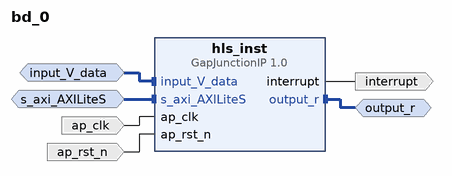
[diagram p0: block diagram of the top level]
# Vivado block design bd_0, xc7z020clg484-1, Vivado 2018.3
create_bd_design bd_0

create_bd_intf_port -mode Slave -vlnv xilinx.com:interface:axis_rtl:1.0 input_V_data
set_property -dict [list \
  CONFIG.FREQ_HZ 100000000.0 \
  CONFIG.HAS_TKEEP 0 \
  CONFIG.HAS_TLAST 0 \
  CONFIG.HAS_TREADY 1 \
  CONFIG.HAS_TSTRB 0 \
  CONFIG.LAYERED_METADATA {xilinx.com:interface:datatypes:1.0 {TDATA {datatype {name {attribs {resolve_type immediate dependency {} format string minimum {} maximum {}} value {}} bitwidth {attribs {resolve_type automatic dependency {} format long minimum {} maximum {}} value 0} bitoffset {attribs {resolve_type immediate dependency {} format long minimum {} maximum {}} value 0} array_type {name {attribs {resolve_type immediate dependency {} format string minimum {} maximum {}} value {}} size {attribs {resolve_type immediate dependency {} format long minimum {} maximum {}} value 2} stride {attribs {resolve_type immediate dependency {} format long minimum {} maximum {}} value 32} datatype {name {attribs {resolve_type immediate dependency {} format string minimum {} maximum {}} value {}} bitwidth {attribs {resolve_type immediate dependency {} format long minimum {} maximum {}} value 32} bitoffset {attribs {resolve_type immediate dependency {} format long minimum {} maximum {}} value 0} real {float {sigwidth {attribs {resolve_type immediate dependency {} format long minimum {} maximum {}} value 24}}}}}}}}} \
  CONFIG.TDATA_NUM_BYTES 8 \
  CONFIG.TDEST_WIDTH 0 \
  CONFIG.TID_WIDTH 0 \
  CONFIG.TUSER_WIDTH 0 \
] [get_bd_intf_ports input_V_data]
create_bd_intf_port -mode Master -vlnv xilinx.com:interface:axis_rtl:1.0 output_r
set_property -dict {CONFIG.FREQ_HZ 100000000.0} [get_bd_intf_ports output_r]
create_bd_intf_port -mode Slave -vlnv xilinx.com:interface:aximm_rtl:1.0 s_axi_AXILiteS
set_property -dict [list \
  CONFIG.ADDR_WIDTH 12 \
  CONFIG.ARUSER_WIDTH 0 \
  CONFIG.AWUSER_WIDTH 0 \
  CONFIG.BUSER_WIDTH 0 \
  CONFIG.DATA_WIDTH 32 \
  CONFIG.FREQ_HZ 100000000.0 \
  CONFIG.HAS_BRESP 1 \
  CONFIG.HAS_BURST 0 \
  CONFIG.HAS_CACHE 0 \
  CONFIG.HAS_LOCK 0 \
  CONFIG.HAS_PROT 0 \
  CONFIG.HAS_QOS 0 \
  CONFIG.HAS_REGION 0 \
  CONFIG.HAS_RRESP 1 \
  CONFIG.HAS_WSTRB 1 \
  CONFIG.ID_WIDTH 0 \
  CONFIG.MAX_BURST_LENGTH 1 \
  CONFIG.NUM_READ_OUTSTANDING 1 \
  CONFIG.NUM_READ_THREADS 1 \
  CONFIG.NUM_WRITE_OUTSTANDING 1 \
  CONFIG.NUM_WRITE_THREADS 1 \
  CONFIG.PROTOCOL AXI4LITE \
  CONFIG.READ_WRITE_MODE READ_WRITE \
  CONFIG.RUSER_BITS_PER_BYTE 0 \
  CONFIG.RUSER_WIDTH 0 \
  CONFIG.SUPPORTS_NARROW_BURST 0 \
  CONFIG.WUSER_BITS_PER_BYTE 0 \
  CONFIG.WUSER_WIDTH 0 \
] [get_bd_intf_ports s_axi_AXILiteS]
create_bd_port -dir I -type clk ap_clk
set_property -dict {CONFIG.FREQ_HZ 100000000.0} [get_bd_ports ap_clk]
create_bd_port -dir I -type rst ap_rst_n
create_bd_port -dir O -type intr interrupt

create_bd_cell -type ip -vlnv xilinx.com:hls:GapJunctionIP:1.0 hls_inst

# ---- connections ----

connect_bd_intf_net -intf_net input_V_data_0_1 [get_bd_intf_ports input_V_data] [get_bd_intf_pins hls_inst/input_V_data]
connect_bd_intf_net [get_bd_intf_ports output_r] [get_bd_intf_pins hls_inst/output_r]
connect_bd_intf_net -intf_net s_axi_AXILiteS_0_1 [get_bd_intf_ports s_axi_AXILiteS] [get_bd_intf_pins hls_inst/s_axi_AXILiteS]
connect_bd_net -net ap_clk_0_1 [get_bd_ports ap_clk] [get_bd_pins hls_inst/ap_clk]
connect_bd_net -net ap_rst_n_0_1 [get_bd_ports ap_rst_n] [get_bd_pins hls_inst/ap_rst_n]
connect_bd_net [get_bd_pins hls_inst/interrupt] [get_bd_ports interrupt]

# ---- address map ----
assign_bd_address -offset 0x000 -range 4K -target_address_space [get_bd_addr_spaces s_axi_AXILiteS] [get_bd_addr_segs hls_inst/s_axi_AXILiteS/Reg]

validate_bd_design
save_bd_design
